# Altium schematic sheet Simple_Foc_Power.schdoc
size 314 x 215 mm
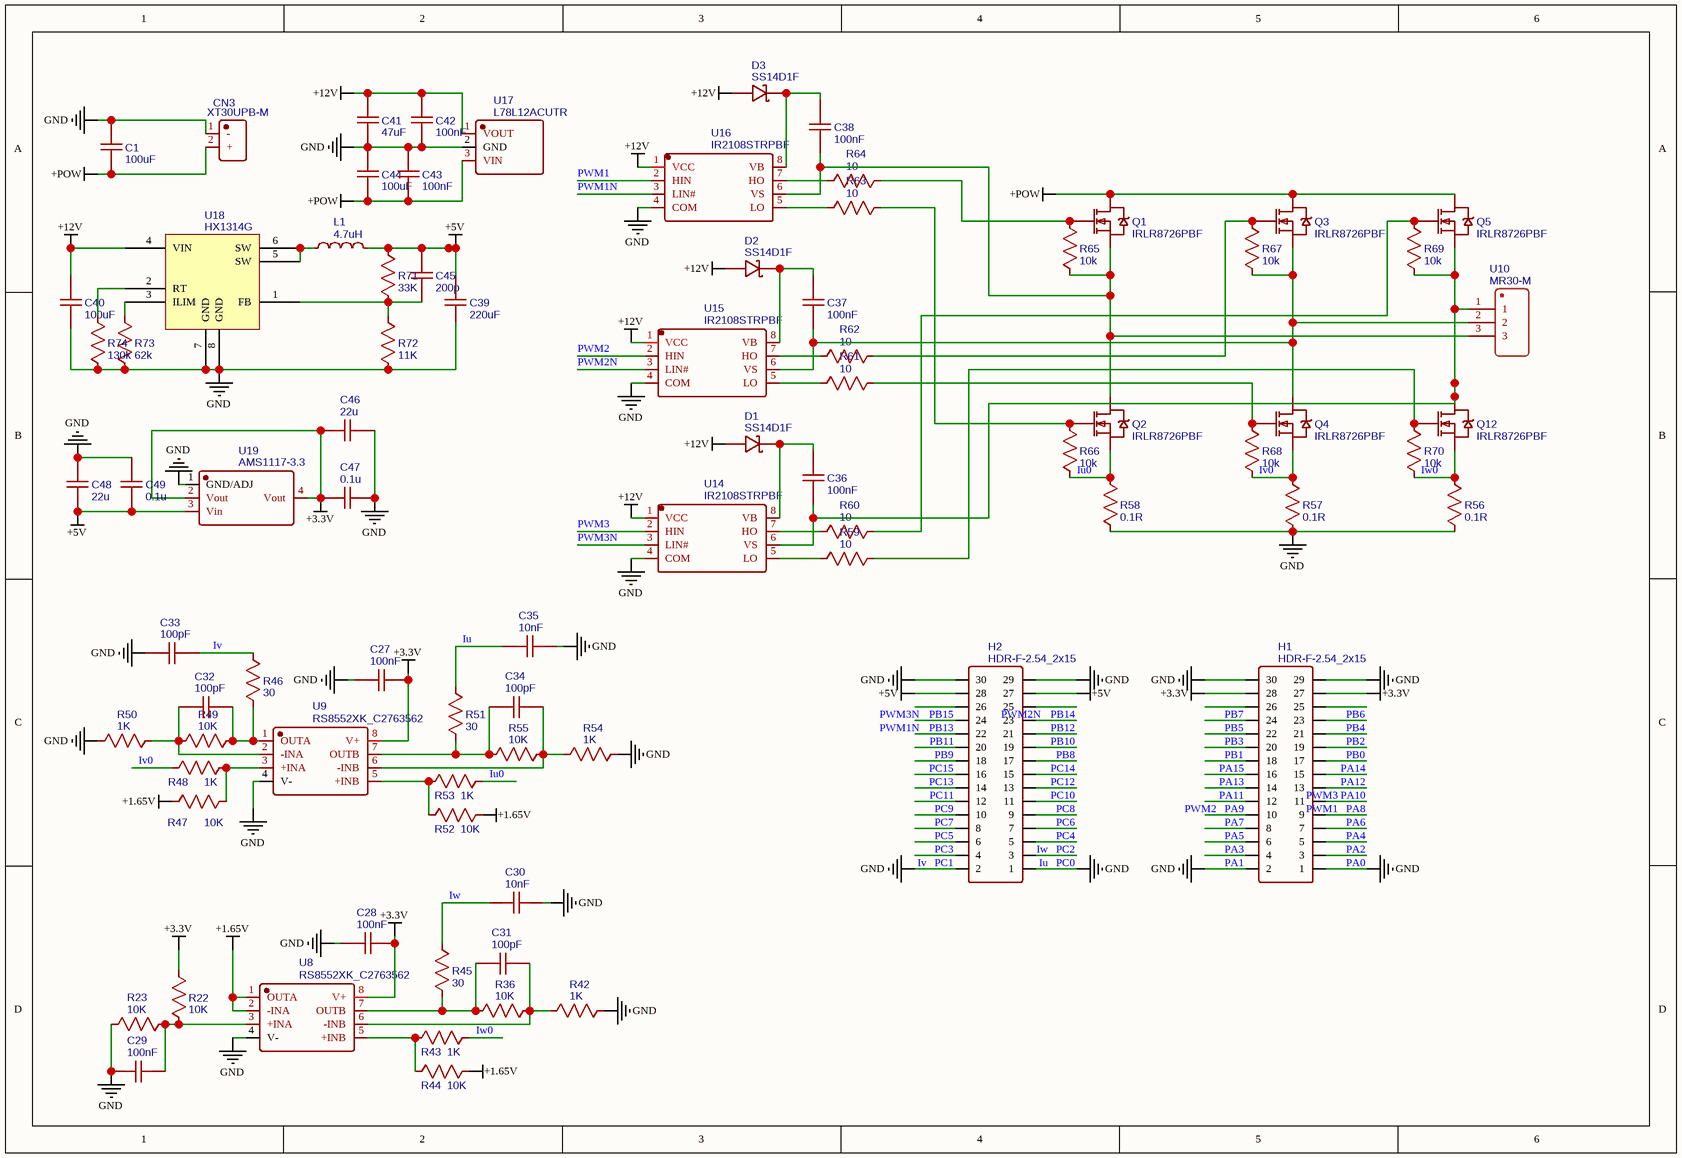
[diagram p0: Simple_Foc_Power.schdoc]

## Parts
C1  100uF  [C1206]
C27  100nF  [C0603]
C28  100nF  [C0603]
C29  100nF  [C0603]
C30  10nF  [C0603]
C31  100pF  [C0603]
C32  100pF  [C0603]
C33  100pF  [C0603]
C34  100pF  [C0603]
C35  10nF  [C0603]
C36  100nF  [C0603]
C37  100nF  [C0603]
C38  100nF  [C0603]
C39  220uF  [C1206]
C40  100uF  [C1206]
C41  47uF  [C1206]
C42  100nF  [C1206]
C43  100nF  [C1206]
C44  100uF  [C1206]
C45  200p  [C0603]
C46  22u  [C0603]
C47  0.1u  [C0603]
C48  22u  [C0603]
C49  0.1u  [C0603]
CN3  XT30UPB-M  [CONN-TH_XT30UPB-M]
D1  SS14D1F  [SOD-123_L2.8-W1.8-LS3.7-RD]
D2  SS14D1F  [SOD-123_L2.8-W1.8-LS3.7-RD]
D3  SS14D1F  [SOD-123_L2.8-W1.8-LS3.7-RD]
H1  HDR-F-2.54_2x15  [HDR-F-2.54_2X15]
H2  HDR-F-2.54_2x15  [HDR-F-2.54_2X15]
L1  4.7uH  [L0805]
Q1  IRLR8726PBF  [TO-252-2_L6.6-W6.1-P4.57-LS9.9-BR-CW]
Q2  IRLR8726PBF  [TO-252-2_L6.6-W6.1-P4.57-LS9.9-BR-CW]
Q3  IRLR8726PBF  [TO-252-2_L6.6-W6.1-P4.57-LS9.9-BR-CW]
Q4  IRLR8726PBF  [TO-252-2_L6.6-W6.1-P4.57-LS9.9-BR-CW]
Q5  IRLR8726PBF  [TO-252-2_L6.6-W6.1-P4.57-LS9.9-BR-CW]
Q12  IRLR8726PBF  [TO-252-2_L6.6-W6.1-P4.57-LS9.9-BR-CW]
R22  10K  [R0603]
R23  10K  [R0603]
R36  10K  [R0603]
R42  1K  [R0603]
R43  1K  [R0603]
R44  10K  [R0603]
R45  30  [R0603]
R46  30  [R0603]
R47  10K  [R0603]
R48  1K  [R0603]
R49  10K  [R0603]
R50  1K  [R0603]
R51  30  [R0603]
R52  10K  [R0603]
R53  1K  [R0603]
R54  1K  [R0603]
R55  10K  [R0603]
R56  0.1R  [R1206]
R57  0.1R  [R1206]
R58  0.1R  [R1206]
R59  10  [R0603]
R60  10  [R0603]
R61  10  [R0603]
R62  10  [R0603]
R63  10  [R0603]
R64  10  [R0603]
R65  10k  [R0603]
R66  10k  [R0603]
R67  10k  [R0603]
R68  10k  [R0603]
R69  10k  [R0603]
R70  10k  [R0603]
R71  33K  [R0603]
R72  11K  [R0603]
R73  62k  [R0603]
R74  130k  [R0603]
U8  RS8552XK_C2763562  [SOIC-8_L4.9-W3.9-P1.27-LS6.0-BL]
U9  RS8552XK_C2763562  [SOIC-8_L4.9-W3.9-P1.27-LS6.0-BL]
U10  MR30-M  [MR30-M]
U14  IR2108STRPBF  [SOIC-8_L4.9-W3.9-P1.27-LS6.0-BL]
U15  IR2108STRPBF  [SOIC-8_L4.9-W3.9-P1.27-LS6.0-BL]
U16  IR2108STRPBF  [SOIC-8_L4.9-W3.9-P1.27-LS6.0-BL]
U17  L78L12ACUTR  [SOT-89-3_L4.5-W2.5-P1.50-LS4.2-TL]
U18  HX1314G  [SOP8]
U19  AMS1117-3.3  [SOT-223-3_L6.5-W3.4-P2.30-LS7.0-BR]

## Nets
+1.65V: R44.2 R47.1 R52.2 U8.1(OUTA) U8.2(-INA)
+3.3V: C27.2 C28.2 C46.1 C47.1 H1.27 H1.28 R22.1 U8.8(V+) U9.8(V+) U19.2(Vout) U19.4(Vout)
+5V: C39.2 C45.2 C48.1 C49.1 H2.27 H2.28 L1.2 R71.2 U19.3(Vin)
+12V: C40.2 C41.2 C42.2 D1.2 D2.2 D3.2 U14.1(VCC) U15.1(VCC) U16.1(VCC) U17.1(VOUT) U18.4(VIN)
+POW: C1.1 C43.1 C44.1 CN3.2(+) Q1.2(D) Q3.2(D) Q5.2(D) U17.3(VIN)
GND: C1.2 C27.1 C28.1 C29.2 C30.1 C33.2 C35.1 C39.1 C40.1 C41.1 C42.1 C43.2 C44.2 C46.2 C47.2 C48.2 C49.2 CN3.1(-) H1.1 H1.2 H1.29 H1.30 H2.1 H2.2 H2.29 H2.30 R23.2 R42.2 R50.1 R54.2 R56.1 R57.1 R58.1 R72.1 R73.1 R74.1 U8.4(V-) U9.4(V-) U14.4(COM) U15.4(COM) U16.4(COM) U17.2(GND) U18.7(GND) U18.8(GND) U19.1(GND/ADJ)
Iu: C35.2 H2.3 R51.2  [also labelled PC0]
Iu0: Q2.3(S) R53.2 R58.2 R66.1
Iv: C33.1 H2.4 R46.2  [also labelled PC1]
Iv0: Q4.3(S) R48.1 R57.2 R68.1
Iw: C30.2 H2.5 R45.2  [also labelled PC2]
Iw0: Q12.3(S) R43.2 R56.2 R70.1
PA0: H1.3
PA1: H1.4
PA2: H1.5
PA3: H1.6
PA4: H1.7
PA5: H1.8
PA6: H1.9
PA7: H1.10
PA8: H1.11 U16.2(HIN)  [also labelled PWM1]
PA9: H1.12 U15.2(HIN)  [also labelled PWM2]
PA10: H1.13 U14.2(HIN)  [also labelled PWM3]
PA11: H1.14
PA12: H1.15
PA13: H1.16
PA14: H1.17
PA15: H1.18
PB0: H1.19
PB1: H1.20
PB2: H1.21
PB3: H1.22
PB4: H1.23
PB5: H1.24
PB6: H1.25
PB7: H1.26
PB8: H2.19
PB9: H2.20
PB10: H2.21
PB11: H2.22
PB12: H2.23
PB13: H2.24 U16.3(LIN#)  [also labelled PWM1N]
PB14: H2.25 U15.3(LIN#)  [also labelled PWM2N]
PB15: H2.26 U14.3(LIN#)  [also labelled PWM3N]
PC3: H2.6
PC4: H2.7
PC5: H2.8
PC6: H2.9
PC7: H2.10
PC8: H2.11
PC9: H2.12
PC10: H2.13
PC11: H2.14
PC12: H2.15
PC13: H2.16
PC14: H2.17
PC15: H2.18
NetC29_1: C29.1 R22.2 R23.1 U8.3(+INA)
NetC31_1: C31.1 R36.2 R42.1 U8.6(-INB)
NetC31_2: C31.2 R36.1 R45.1 U8.7(OUTB)
NetC32_1: C32.1 R46.1 R49.2 U9.1(OUTA)
NetC32_2: C32.2 R49.1 R50.2 U9.2(-INA)
NetC34_1: C34.1 R54.1 R55.2 U9.6(-INB)
NetC34_2: C34.2 R51.1 R55.1 U9.7(OUTB)
NetC36_1: C36.1 Q5.3(S) Q12.2(D) R69.1 U10.1 U14.6(VS)
NetC36_2: C36.2 D1.1 U14.8(VB)
NetC37_1: C37.1 Q3.3(S) Q4.2(D) R67.1 U10.2 U15.6(VS)
NetC37_2: C37.2 D2.1 U15.8(VB)
NetC38_1: C38.1 Q1.3(S) Q2.2(D) R65.1 U10.3 U16.6(VS)
NetC38_2: C38.2 D3.1 U16.8(VB)
NetC45_1: C45.1 R71.1 R72.2 U18.1(FB)
NetL1_1: L1.1 U18.5(SW) U18.6(SW)
NetQ1_1: Q1.1(G) R64.2 R65.2
NetQ2_1: Q2.1(G) R63.2 R66.2
NetQ3_1: Q3.1(G) R62.2 R67.2
NetQ4_1: Q4.1(G) R61.2 R68.2
NetQ5_1: Q5.1(G) R60.2 R69.2
NetQ12_1: Q12.1(G) R59.2 R70.2
NetR43_1: R43.1 R44.1 U8.5(+INB)
NetR47_2: R47.2 R48.2 U9.3(+INA)
NetR52_1: R52.1 R53.1 U9.5(+INB)
NetR59_1: R59.1 U14.5(LO)
NetR60_1: R60.1 U14.7(HO)
NetR61_1: R61.1 U15.5(LO)
NetR62_1: R62.1 U15.7(HO)
NetR63_1: R63.1 U16.5(LO)
NetR64_1: R64.1 U16.7(HO)
NetR73_2: R73.2 U18.3(ILIM)
NetR74_2: R74.2 U18.2(RT)

## Library data of the parts
C1 C40 C44 = 100uF: nameAlias: Value(F); Contributor: LCEDA_Lib; spicePre: C; spiceSymbolName: C_1206_US
C27-C29 C36-C38 C42 C43 = 100nF: nameAlias: Value(F); Contributor: LCEDA_Lib; spicePre: C
  C27-C29 C36-C38: spiceSymbolName: C_0603_US
  C42 C43: spiceSymbolName: C_1206_US
C30 C35 = 10nF: nameAlias: Value(F); Contributor: LCEDA_Lib; spicePre: C; spiceSymbolName: C_0603_US
C31-C34 = 100pF: nameAlias: Value(F); Contributor: LCEDA_Lib; spicePre: C; spiceSymbolName: C_0603_US
C39 = 220uF: nameAlias: Value(F); Contributor: LCEDA_Lib; spicePre: C; spiceSymbolName: C_1206_US
C41 = 47uF: nameAlias: Value(F); Contributor: LCEDA_Lib; spicePre: C; spiceSymbolName: C_1206_US
C45 = 200p: nameAlias: Value(F); Contributor: LCEDA_Lib; spicePre: C; spiceSymbolName: C_0603_US
C46 C48 = 22u: nameAlias: Value(F); Contributor: LCEDA_Lib; spicePre: C; spiceSymbolName: C_0603_US
C47 C49 = 0.1u: nameAlias: Value(F); Contributor: LCEDA_Lib; spicePre: C; spiceSymbolName: C_0603_US
CN3 = XT30UPB-M: BOM_Manufacturer: Changzhou Amass Elec; Contributor: LCSC; BOM_Supplier: LCSC; BOM_Supplier Part: C428721; BOM_Manufacturer Part: XT30UPB-M; BOM_JLCPCB Part Class: Extended Part; spicePre: C; spiceSymbolName: XT30UPB-M
D1-D3 = SS14D1F: BOM_Manufacturer: PN SILICON; Contributor: LCSC; BOM_Supplier: LCSC; BOM_Supplier Part: C555467; BOM_Manufacturer Part: SS14D1F; BOM_JLCPCB Part Class: Extended Part; spicePre: D; spiceSymbolName: SS14D1F
H1 H2 = HDR-F-2.54_2x15: Contributor: LCEDA_Lib; BOM_Supplier Part: C169818; BOM_Supplier: LCSC; spicePre: H; spiceSymbolName: HDR-F-2.54_2x15
L1 = 4.7uH: nameAlias: Value(H); Contributor: LCEDA_Lib; spicePre: L; spiceSymbolName: L0805_US
Q1-Q5 Q12 = IRLR8726PBF: BOM_Manufacturer: Infineon; BOM_Supplier: LCSC; BOM_Manufacturer Part: IRLR8726PBF; BOM_Supplier Part: C110317; BOM_JLCPCB Part Class: Extended Part; spicePre: Q; spiceSymbolName: IRLR8726PBF
R22 R23 R36 R44 R47 R49 R52 R55 = 10K: nameAlias: Value(Ω); Contributor: LCEDA_Lib; spicePre: R; spiceSymbolName: R_0603_US
R42 R43 R48 R50 R53 R54 = 1K: nameAlias: Value(Ω); Contributor: LCEDA_Lib; spicePre: R; spiceSymbolName: R_0603_US
R45 R46 R51 = 30: nameAlias: Value(Ω); Contributor: LCEDA_Lib; spicePre: R; spiceSymbolName: R_0603_US
R56-R58 = 0.1R: nameAlias: Value(Ω); Contributor: LCEDA_Lib; spicePre: R; spiceSymbolName: R_1206_US
R59-R64 = 10: nameAlias: Value(Ω); Contributor: LCEDA_Lib; spicePre: R; spiceSymbolName: R_0603_US
R65-R70 = 10k: nameAlias: Value(Ω); Contributor: LCEDA_Lib; spicePre: R; spiceSymbolName: R_0603_US
R71 = 33K: nameAlias: Value(Ω); Contributor: LCEDA_Lib; spicePre: R; spiceSymbolName: R_0603_US
R72 = 11K: nameAlias: Value(Ω); Contributor: LCEDA_Lib; spicePre: R; spiceSymbolName: R_0603_US
R73 = 62k: nameAlias: Value(Ω); Contributor: LCEDA_Lib; spicePre: R; spiceSymbolName: R_0603_US
R74 = 130k: nameAlias: Value(Ω); Contributor: LCEDA_Lib; spicePre: R; spiceSymbolName: R_0603_US
U8 U9 = RS8552XK_C2763562: BOM_Manufacturer: RUNIC(润石); Contributor: LCSC; BOM_Supplier: LCSC; BOM_Supplier Part: C2763562; BOM_Manufacturer Part: RS8552XK; BOM_JLCPCB Part Class: Extended Part; spicePre: U; spiceSymbolName: RS8552XK_C2763562
U10 = MR30-M: Contributor: 杜邦线丶小战士; spicePre: U; spiceSymbolName: MR30-M
U14-U16 = IR2108STRPBF: BOM_Manufacturer: Infineon; spicePre: X; BOM_Supplier: LCSC; BOM_Manufacturer Part: IR2108STRPBF; BOM_Supplier Part: C2964; BOM_JLCPCB Part Class: Extended Part; spiceSymbolName: IR2108STRPBF
U17 = L78L12ACUTR: BOM_Manufacturer: STMicroelectronics; Contributor: LCSC; BOM_Supplier: LCSC; BOM_Manufacturer Part: L78L12ACUTR; BOM_Supplier Part: C69601; BOM_JLCPCB Part Class: Extended Part; spicePre: U; spiceSymbolName: L78L12ACUTR
U18 = HX1314G: Contributor: lzhfz_0591; spicePre: U; spiceSymbolName: HX1314G
U19 = AMS1117-3.3: BOM_Manufacturer: AMS; sourceId: dwIGgezVh; timeStamp: 1476261164; BOM_Supplier: LCSC; BOM_Manufacturer Part: AMS1117-3.3; BOM_Supplier Part: C6186; BOM_JLCPCB Part Class: Basic Part; spicePre: U; spiceSymbolName: AMS1117-3.3